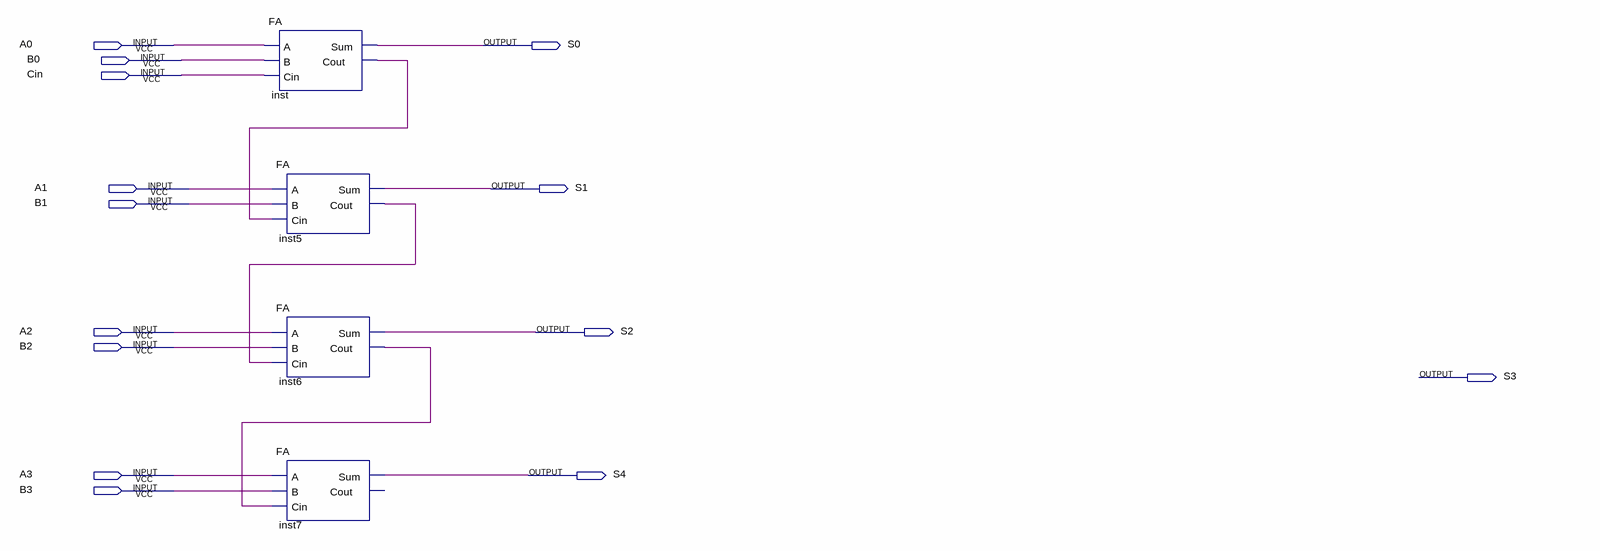
[diagram p0: schematic sheet]
// Quartus schematic 4B_FA.bdf as structural Verilog: 4 symbols, 14 pins
module \4B_FA  (
  input  A0,
  input  B0,
  input  Cin,
  input  A1,
  input  B1,
  input  A2,
  input  B2,
  input  A3,
  input  B3,
  output S0,
  output S1,
  output S2,
  output S3,
  output S4
);

  wire inst5_cout, inst6_cout, inst_cout;

  FA inst (.A(A0), .B(B0), .Cin(Cin), .Sum(S0), .Cout(inst_cout));
  FA inst5 (.A(A1), .B(B1), .Cin(inst_cout), .Sum(S1), .Cout(inst5_cout));
  FA inst6 (.A(A2), .B(B2), .Cin(inst5_cout), .Sum(S2), .Cout(inst6_cout));
  FA inst7 (.A(A3), .B(B3), .Cin(inst6_cout), .Sum(S4));  // open: Cout
endmodule
